# EAGLE design sliding protentiometer-v2.0 (EAGLE 6.6.0)
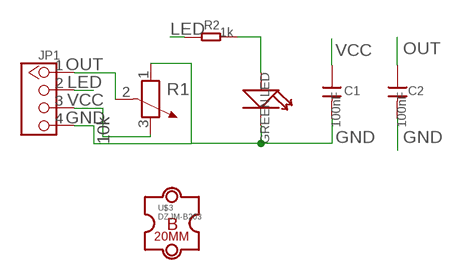
[diagram p0: schematic, sheet 1]

## Parts
C1  100nF  C-0805  [0805]
C2  100nF  C-0805  [0805]
JP1  M0410  [JMZY-1X4]
LED  GREEN  LED'0805'  [LED-0805]
R1  10k  R-POTENTIOMETER  [3P-SQUA-45.6X10X5.8H]
R2  1k  R-0805  [0805]
U$3  DZJM-B203  [DZJM-B20-3P]

## Nets
GND: C1.2 C2.2 JP1.4 LED.- R1.1
LED: JP1.2 R2.1
N$5: LED.+ R2.2
OUT: C2.1 JP1.1 R1.2
VCC: C1.1 JP1.3 R1.3

## Library data of the parts
C1 C2 = Discrete:C*: Ceramic Capacitors
JP1 = duinofun-connector:M04: Header 4 Standard 4-pin 0.1" header. Use with straight break away headers (SKU : PRT-00116), right angle break away headers (PRT-00553), swiss pins (PRT-00743), machine pins (PRT-00117), and female headers (PRT-00115). Molex polarized connector foot print use with SKU : PRT-08231 with associated crimp pins and housings. 1MM SMD Version SKU: PRT-10208
LED = Discrete:LED*
R1 = Discrete:R-POTENTIOMETER*: Potentiometer
R2 = Discrete:R*
U$3 = duinofun-outline:DZJM-B20

## Board
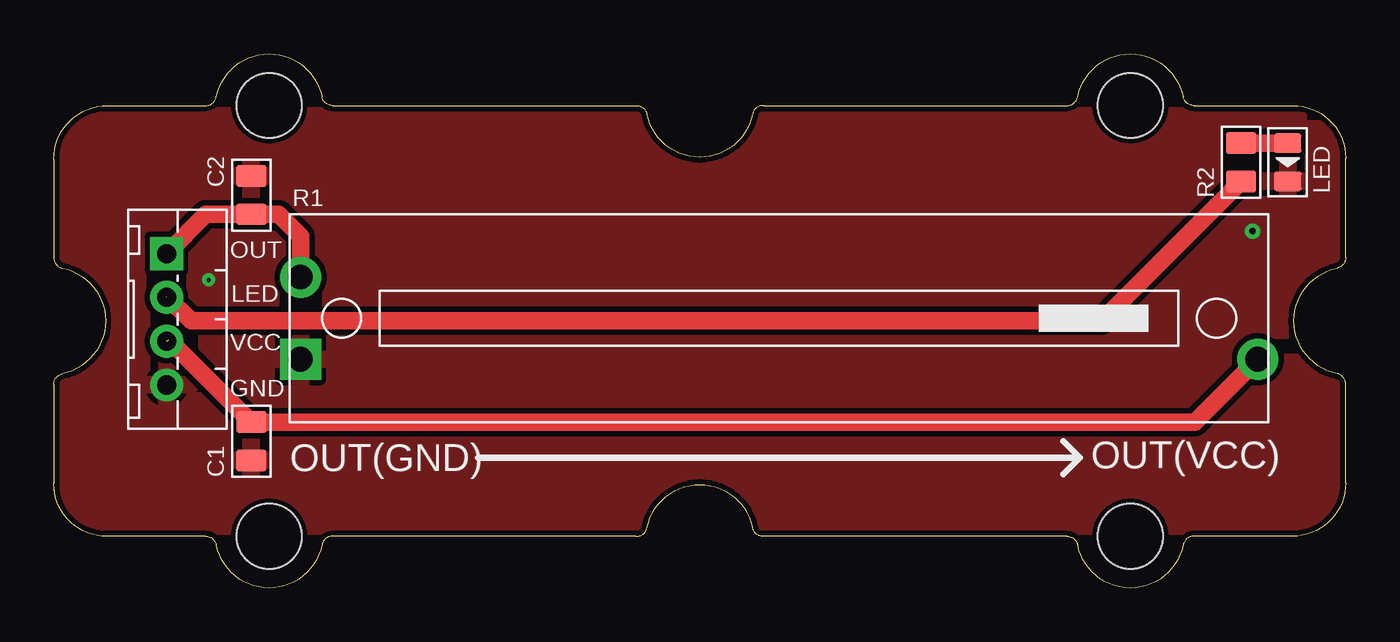
[diagram p1: board, top side]
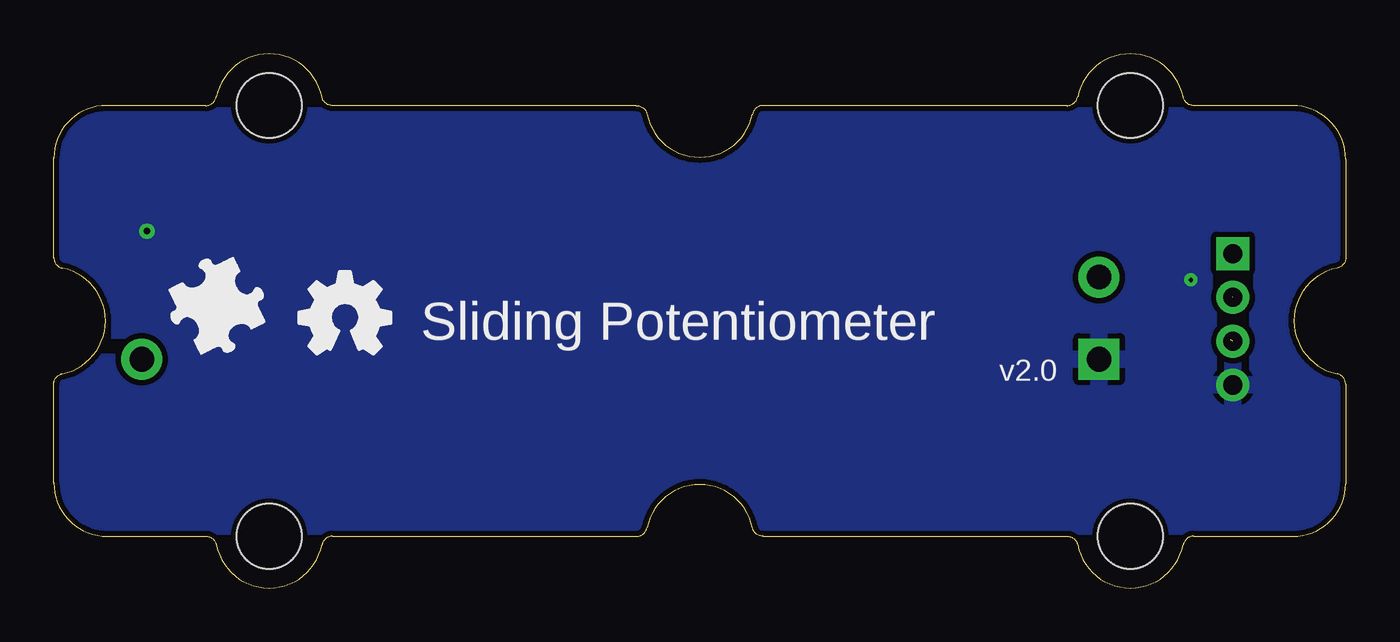
[diagram p2: board, bottom side, seen from below]

Size 60 x 24.8 mm. Coordinates in mm from the lower left corner, seen from the top.
Copper layers (1*16): Top 0.035mm / dielectric 1.5mm / Bottom 0.035mm
Design rules "default": minimum track width 6mil, minimum drill 12mil, track to track 6mil, track to pad 6mil, pad to pad 6mil, via to via 6mil, smd to smd 6mil, copper to edge 10mil, drill to drill 10mil, minimum pad ring 10mil, minimum via ring 8mil, stop-mask expansion 2mil, vias tented up to drill 100mil, thermal gap 10mil

### Footprints (pad centres in the part's own frame; a part is rotated, then mirrored left to right if it is on the bottom)
0805 = smd 1.016 x 1.397: 1 -0.889,0; 2 0.889,0
JMZY-1X4 = drill 0.889 pad 1.524 square: 1 2.032,1.778 | drill 0.889 pad 1.524: 2 4.064,1.778; 3 6.096,1.778; 4 8.128,1.778
LED-0805 = smd 0.889 x 1.27: + -0.889,0; - 0.889,0
3P-SQUA-45.6X10X5.8H = drill 1.143 pad 1.905 square: 1 -22.225,-1.905 | drill 1.143 pad 1.905: 2 -22.225,1.905; 3 22.225,-1.905
DZJM-B20-3P = hole 3: -20,10; -20,-10; 20,10; 20,-10

### Placement (x,y rotation side)
C1  9.17,6.81 270 top
C2  9.17,18.24 90 top
JP1  3.46,17.56 270 top
LED  57.3,19.77 270 top
R1  33.68,12.53 0 top
R2  55.15,19.77 90 top
U$1  [BRICK-LOGO-MIL-0.5]  54.96,10.56 0 bottom
U$2  [OSHW_FILLX150_NOTEXT]  48.61,10.88 0 bottom
U$3  30,12.4 0 top

### Tracks (layer width: path | path; a pad name or v marks a point on that pad's centre or on a via)
GND  (via drill 0.2, 0.3 pad 0.64)
  other vias: 55.68,16.57 7.19,14.31
  pour Bottom (isolate 0.254): -3.15,25.48 -3.15,-2.46 62.89,-2.46 62.89,-1.19 62.89,26.75 -3.15,26.75
  pour Top (isolate 0.254): -0.61,-1.19 61.62,-1.19 61.62,25.48 -1.88,25.48 -1.88,-1.19
LED  (1 unrouted)
  Top 0.813: 5.25,13.53 6.38,12.4 48.67,12.4 R2.1
N$5
  Top 0.813: R2.2 LED.+
OUT
  Top 0.813: R1.2 11.46,16.34 10.44,17.35 C2.1 7.06,17.35 JP1.1
VCC  (1 unrouted)
  Top 0.813: 5.35,11.53 C1.1 52.99,7.7 R1.3

### Text on the board
tPlace: OUT(VCC) | OUT(GND)
bPlace: Sliding Potentiometer | v2.0
tNames: OUT | LED | VCC | GND